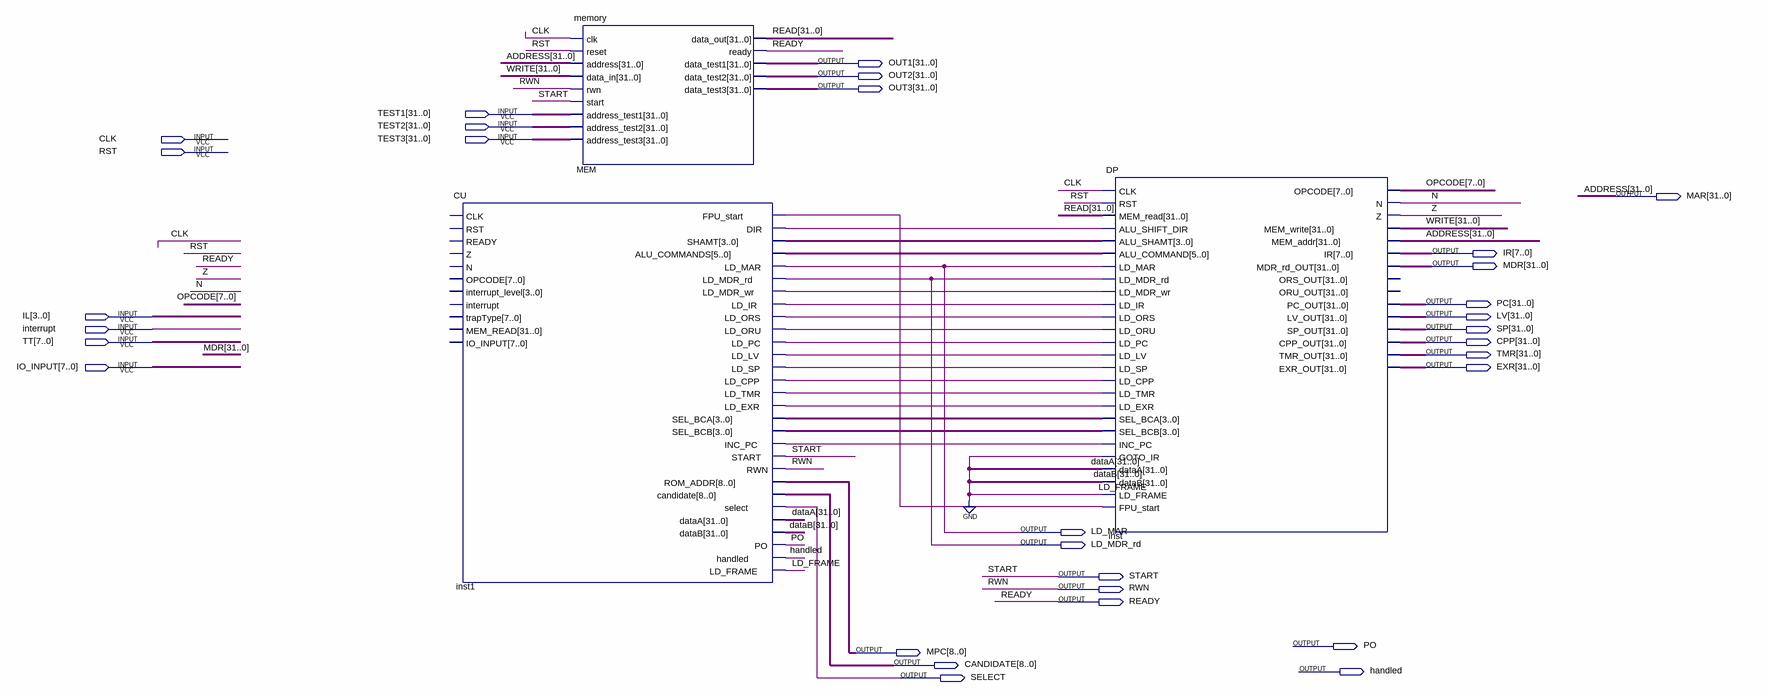
[diagram p0: schematic sheet]
// Quartus schematic CPU.bdf as structural Verilog: 3 symbols, 31 pins
module CPU (
  input  [31:0] TEST1,
  input  [31:0] TEST2,
  input  CLK,
  input  [31:0] TEST3,
  input  RST,
  input  [3:0] IL,
  input  interrupt,
  input  [7:0] TT,
  input  [7:0] IO_INPUT,
  output [31:0] OUT1,
  output [31:0] OUT2,
  output [31:0] OUT3,
  output [31:0] MAR,
  output [7:0] IR,
  output [31:0] MDR,
  output [31:0] PC,
  output [31:0] LV,
  output [31:0] SP,
  output [31:0] CPP,
  output [31:0] TMR,
  output [31:0] EXR,
  output LD_MAR,
  output LD_MDR_rd,
  output START,
  output RWN,
  output READY,
  output PO,
  output [8:0] MPC,
  output [8:0] CANDIDATE,
  output handled,
  output SELECT
);

  wire inst1_dir, inst1_fpu_start, inst1_inc_pc, inst1_ld_cpp, inst1_ld_exr, inst1_ld_ir, inst1_ld_lv,
       inst1_ld_mdr_wr, inst1_ld_ors, inst1_ld_oru, inst1_ld_pc, inst1_ld_sp, inst1_ld_tmr, LD_FRAME, N, Z;
  wire [3:0] inst1_sel_bca, inst1_sel_bcb, inst1_shamt;
  wire [5:0] inst1_alu_commands;
  wire [7:0] OPCODE;
  wire [31:0] dataA, dataB, READ, WRITE;

  CU inst1 (
    .FPU_start(inst1_fpu_start), .DIR(inst1_dir), .SHAMT(inst1_shamt), .ALU_COMMANDS(inst1_alu_commands),
    .LD_MAR(LD_MAR), .LD_MDR_rd(LD_MDR_rd), .LD_MDR_wr(inst1_ld_mdr_wr), .LD_IR(inst1_ld_ir),
    .LD_ORS(inst1_ld_ors), .LD_ORU(inst1_ld_oru), .LD_PC(inst1_ld_pc), .LD_LV(inst1_ld_lv),
    .LD_SP(inst1_ld_sp), .LD_CPP(inst1_ld_cpp), .LD_TMR(inst1_ld_tmr), .LD_EXR(inst1_ld_exr),
    .SEL_BCA(inst1_sel_bca), .SEL_BCB(inst1_sel_bcb), .INC_PC(inst1_inc_pc), .START(START), .RWN(RWN),
    .ROM_ADDR(MPC), .candidate(CANDIDATE), .select(SELECT), .dataA(dataA), .dataB(dataB), .PO(PO),
    .handled(handled), .LD_FRAME(LD_FRAME));  // open: CLK, RST, READY, Z, N, OPCODE, interrupt_level, interrupt, trapType, MEM_READ, IO_INPUT
  memory MEM (
    .clk(CLK), .reset(RST), .address(MAR), .data_in(WRITE), .rwn(RWN), .start(START), .address_test1(TEST1),
    .address_test2(TEST2), .address_test3(TEST3), .data_out(READ), .ready(READY), .data_test1(OUT1),
    .data_test2(OUT2), .data_test3(OUT3));
  DP inst (
    .CLK(CLK), .RST(RST), .MEM_read(READ), .ALU_SHIFT_DIR(inst1_dir), .ALU_SHAMT(inst1_shamt),
    .ALU_COMMAND(inst1_alu_commands), .LD_MAR(LD_MAR), .LD_MDR_rd(LD_MDR_rd), .LD_MDR_wr(inst1_ld_mdr_wr),
    .LD_IR(inst1_ld_ir), .LD_ORS(inst1_ld_ors), .LD_ORU(inst1_ld_oru), .LD_PC(inst1_ld_pc),
    .LD_LV(inst1_ld_lv), .LD_SP(inst1_ld_sp), .LD_CPP(inst1_ld_cpp), .LD_TMR(inst1_ld_tmr),
    .LD_EXR(inst1_ld_exr), .SEL_BCA(inst1_sel_bca), .SEL_BCB(inst1_sel_bcb), .INC_PC(inst1_inc_pc),
    .GOTO_IR(LD_FRAME), .dataA(dataA), .dataB(dataB), .LD_FRAME(LD_FRAME), .FPU_start(inst1_fpu_start),
    .OPCODE(OPCODE), .N(N), .Z(Z), .MEM_write(WRITE), .MEM_addr(MAR), .IR(IR), .MDR_rd_OUT(MDR), .PC_OUT(PC),
    .LV_OUT(LV), .SP_OUT(SP), .CPP_OUT(CPP), .TMR_OUT(TMR), .EXR_OUT(EXR));  // open: ORS_OUT, ORU_OUT
  // also tied to GND on the sheet: LD_FRAME

  // Other names for the same wires on the sheet: ADDRESS[31:0] = MAR
endmodule
